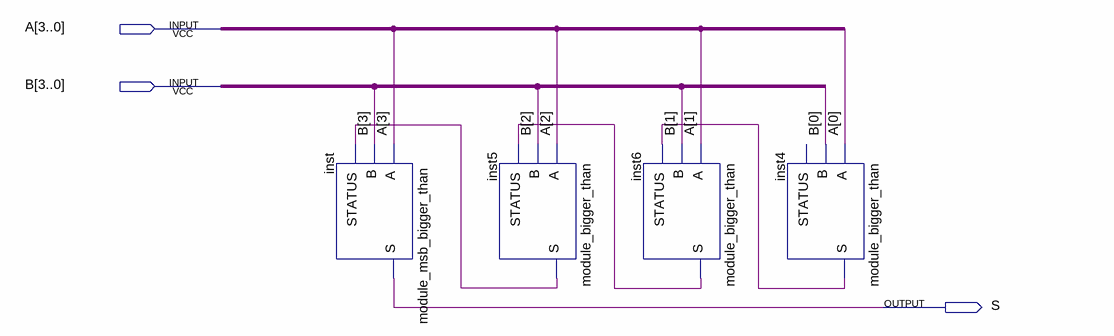
[diagram p0: schematic sheet]
// Quartus schematic module_4b_bigger_than.bdf as structural Verilog: 4 symbols, 3 pins
module module_4b_bigger_than (
  input  [3:0] A,
  input  [3:0] B,
  output S
);

  wire inst4_s, inst5_s, inst6_s;

  module_msb_bigger_than inst (.A(A[3]), .B(B[3]), .STATUS(inst5_s), .S(S));
  module_bigger_than inst5 (.A(A[2]), .B(B[2]), .STATUS(inst6_s), .S(inst5_s));
  module_bigger_than inst6 (.A(A[1]), .B(B[1]), .STATUS(inst4_s), .S(inst6_s));
  module_bigger_than inst4 (.A(A[0]), .B(B[0]), .S(inst4_s));  // open: STATUS
endmodule
